# Altium schematic sheet DAC_AND_MIC.SchDoc
size A4; SheetNumber: 8; SheetTotal: 12
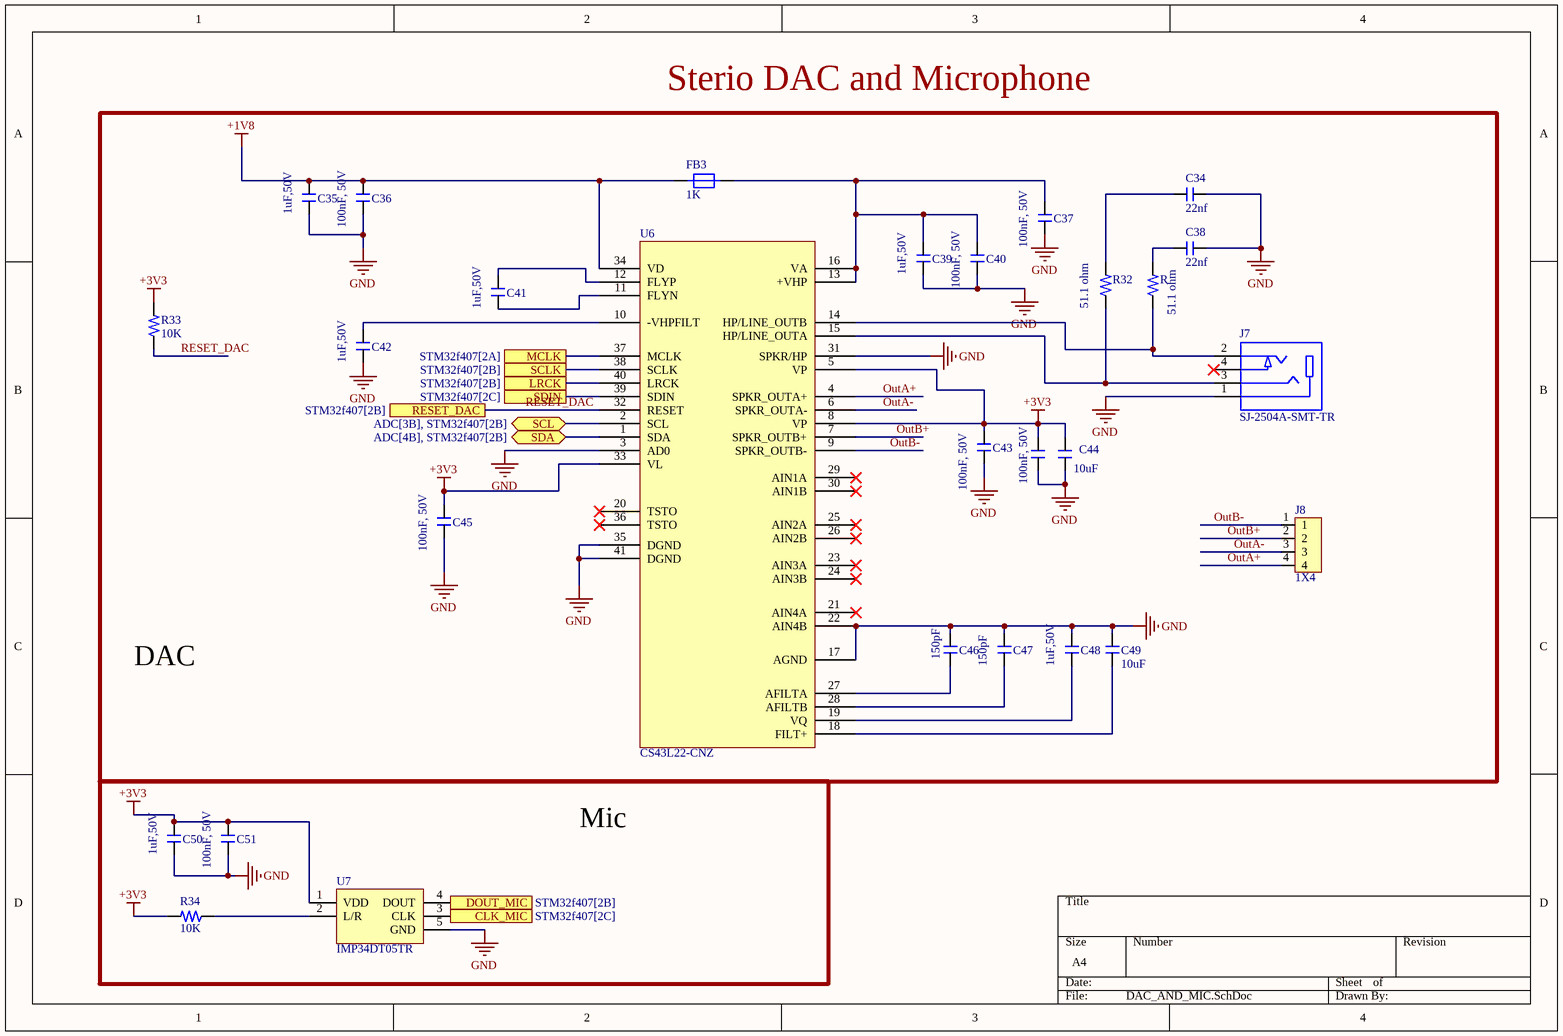
[diagram p0: DAC_AND_MIC.SchDoc]

## Parts
?  10uF  [Capacitor_1206_SMD]
C34  22nf  [Capacitor_0805]
C35  1uF,50V  [Capacitor_0805]
C36  100nF, 50V  [Capacitor_0805]
C37  100nF, 50V  [Capacitor_0805]
C38  22nf  [Capacitor_0805]
C39  1uF,50V  [Capacitor_0805]
C40  100nF, 50V  [Capacitor_0805]
C41  1uF,50V  [Capacitor_0805]
C42  1uF,50V  [Capacitor_0805]
C43  100nF, 50V  [Capacitor_0805]
C44  100nF, 50V  [Capacitor_0805]
C45  100nF, 50V  [Capacitor_0805]
C46  150pF  [Capacitor_0805]
C47  150pF  [Capacitor_0805]
C48  1uF,50V  [Capacitor_0805]
C49  10uF  [Capacitor_1206_SMD]
C50  1uF,50V  [Capacitor_0805]
C51  100nF, 50V  [Capacitor_0805]
FB3  1K  [FB_0805]
J7  SJ-2504A-SMT-TR  [CON_SJ-2504A-SMT-TR_SMD]
J8  1X4  [Header_1X4_2.54mm]
R  51.1 ohm  [Resistor_0603]
R32  51.1 ohm  [Resistor_0603]
R33  10K  [Resistor_0603]
R34  10K  [Resistor_0603]
U6  CS43L22-CNZ  [QFN40_19_284_33X9_SMD]
U7  IMP34DT05TR  [HCLGA-4_53_137_15X37_SMD]

## Blocks framed on the sheet
Sterio DAC and Microphone: ? C34-C49 FB3 J7 J8 R R32 R33 U6
Mic: C50 C51 R34 U7

## Ports
CLK_MIC (in, see STM32f407[2C]), DOUT_MIC (out, see STM32f407[2B]), LRCK (see STM32f407[2B]), MCLK (see STM32f407[2A]), RESET_DAC (see STM32f407[2B]), SCL (bidir, see ADC[3B], STM32f407[2B]), SCLK (see STM32f407[2B]), SDA (bidir, see ADC[4B], STM32f407[2B]), SDIN (see STM32f407[2C])

## Nets
+1V8: C35.2 C36.2 FB3.1 U6.34(VD)
+3V3: ?.2 C43.2 C44.2 C45.2 C50.2 C51.2 R33.2 R34.2 U6.5(VP) U6.8(VP) U6.33(VL) U7.1(VDD)
GND: ?.1 C34.2 C35.1 C36.1 C37.1 C38.2 C39.1 C40.1 C42.1 C43.1 C44.1 C45.1 C46.2 C47.2 C48.2 C49.2 C50.1 C51.1 J7.1 U6.3(AD0) U6.17(AGND) U6.22(AIN4B) U6.31(SPKR/HP) U6.35(DGND) U6.41(DGND) U7.5(GND)
CLK_MIC: U7.3(CLK) ; port CLK_MIC
DOUT_MIC: U7.4(DOUT) ; port DOUT_MIC
LRCK: U6.40(LRCK) ; port LRCK
MCLK: U6.37(MCLK) ; port MCLK
OutA+: J8.4 U6.4(SPKR_OUTA+)
OutA-: J8.3 U6.6(SPKR_OUTA-)
OutB+: J8.2 U6.7(SPKR_OUTB+)
OutB-: J8.1 U6.9(SPKR_OUTB-)
RESET_DAC: R33.1 U6.32(RESET) ; port RESET_DAC
SCL: U6.2(SCL) ; port SCL
SCLK: U6.38(SCLK) ; port SCLK
SDA: U6.1(SDA) ; port SDA
SDIN: U6.39(SDIN) ; port SDIN
NetC34_1: C34.1 R32.2
NetC37_2: C37.2 C39.2 C40.2 FB3.2 U6.13(+VHP) U6.16(VA)
NetC38_1: C38.1 R.2
NetC41_1: C41.1 U6.11(FLYN)
NetC41_2: C41.2 U6.12(FLYP)
NetC42_2: C42.2 U6.10(-VHPFILT)
NetC46_1: C46.1 U6.27(AFILTA)
NetC47_1: C47.1 U6.28(AFILTB)
NetC48_1: C48.1 U6.19(VQ)
NetC49_1: C49.1 U6.18(FILT+)
NetJ7_2: J7.2 R.1 U6.14(HP/LINE_OUTB)
NetJ7_3: J7.3 R32.1 U6.15(HP/LINE_OUTA)
NetR34_1: R34.1 U7.2(L/R)

Not connected (* = marked no-connect by the designer): J7 4*; U6 20(TSTO)* 21(AIN4A)* 23(AIN3A)* 24(AIN3B)* 25(AIN2A)* 26(AIN2B)* 29(AIN1A)* 30(AIN1B)* 36(TSTO)*

## Notes on the sheet
- DAC

## Library data of the parts
? C49 = Cap_10uF_1206: Multilayer Ceramic Capacitor, 10 uF, 50 V, ï¿½ 10%, X7R, 1206 [3216 Metric]; Manufacturer: Samsung; Manufacturer Part Number: CL31B106KBHNNNE; Voltage Rating (DC): 50V; Supplier: Digikey; Supplier Part Number: 1276-6767-1-ND; RoHS: Yes; Category: Ceramic Capacitors; Stock: 207136; Pricing: 1=0,25, 10=0,15, 100=0,1008, 1000=0,0728 (USD); Mounting Technology: Surface Mount; Case/Package: 1206; Case Code (Metric): 3216; Case Code (Imperial): 1206; Material: Ceramic; Min Operating Temperature: -55°C; Max Operating Temperature: 125°C; Value: 10uF; Tolerance: 10%; Dielectric: X7R; Packaging: Cut Tape; Voltage Rating: 50V; Series: CL; Height: 1.8mm; Lead Free: Lead Free; RoHS Compliant: Yes; ComponentLink1URL: https://datasheet.octopart.com/CL31B106KBHNNNE-Samsung-Electro-Mechanics-datasheet-149066874.pdf?src-supplier=Future+Electronics; ComponentLink1Description: https://datasheet.octopart.com/CL31B106KBHNNNE-Samsung-Electro-Mechanics-datasheet-149066874.pdf?src-supplier=Future+Electronics; ComponentLink2URL: http://www.samsungsem.com/kr/support/product-search/mlcc/CL31B106KBHNNNE.jsp?src-supplier=Digikey; ComponentLink2Description: http://www.samsungsem.com/kr/support/product-search/mlcc/CL31B106KBHNNNE.jsp?src-supplier=Digikey; ComponentLink3URL: https://datasheet.octopart.com/CL31B106KBHNNNE-Samsung-Electro-Mechanics-datasheet-137256395.pdf?src-supplier=Farnell; ComponentLink3Description: https://datasheet.octopart.com/CL31B106KBHNNNE-Samsung-Electro-Mechanics-datasheet-137256395.pdf?src-supplier=Farnell; ComponentLink4URL: https://datasheet.octopart.com/CL31B106KBHNNNE-Samsung-Electro-Mechanics-datasheet-110617700.pdf?src-supplier=LCSC; ComponentLink4Description: https://datasheet.octopart.com/CL31B106KBHNNNE-Samsung-Electro-Mechanics-datasheet-110617700.pdf?src-supplier=LCSC
C34 C38 = CAP_22nf_0805: Multilayer Ceramic Capacitor, 0.022 uF, 50 V, ± 10%, X7R, 0805 [2012 Metric]; Manufacturer: Samsung; Manufacturer Part Number: CL21B223KBANNNC; Voltage: 50V; Supplier: Arrow Electronics; Supplier Part Number: CL21B223KBANNNC; RoHS: Yes; Category: Ceramic Capacitors; Stock: 1612000; Pricing: 32000=0,0032 (USD); Mounting Technology: Surface Mount; Case/Package: 0805; Case Code (Metric): 2012; Case Code (Imperial): 0805; Material: Ceramic; Min Operating Temperature: -55°C; Max Operating Temperature: 125°C; Tolerance: 10%; Value: 22nF; Dielectric: X7R; Voltage Rating (DC): 50V; Packaging: Tape and Reel; Package Quantity: 1; Voltage Rating: 50V; Series: CL; Construction: Flat; Length: 2mm; Width: 0.049inch; Height: 0.65mm; Depth: 1.25mm; Thickness: 0.03inch; Radiation Hardening: No; RoHS Compliant: Yes; ComponentLink1URL: https://datasheet.ciiva.com/25800/cl21b223kbannnc-25800850.pdf?src-supplier=Digikey; ComponentLink1Description: https://datasheet.ciiva.com/25800/cl21b223kbannnc-25800850.pdf?src-supplier=Digikey; ComponentLink2URL: https://datasheet.ciiva.com/26838/getdatasheetpartid-498011-26838697.pdf?src-supplier=Verical; ComponentLink2Description: https://datasheet.ciiva.com/26838/getdatasheetpartid-498011-26838697.pdf?src-supplier=Verical; ComponentLink3URL: https://datasheet.ciiva.com/29199/454724-da-01-en-vs-kondensator-0805-29199517.pdf?src-supplier=Conrad; ComponentLink3Description: https://datasheet.ciiva.com/29199/454724-da-01-en-vs-kondensator-0805-29199517.pdf?src-supplier=Conrad
C35 C39 C41 C42 C48 C50 = Cap_1uF_0805: 0805 1 uF 50 V ±5 % Tolerance X7R Surface Mount Multilayer Ceramic Capacitor; Manufacturer: Yageo; Manufacturer Part Number: CC0805JKX7R9BB105; Material: 4241ConductorMaterial; Dielectric: 1511DielectricType; Supplier: Digikey; Supplier Part Number: 311-3498-1-ND; RoHS: Yes; Category: Ceramic Capacitors; Stock: 30160; Pricing: 1=0,29, 10=0,168, 100=0,1077, 1000=0,07673 (USD); Voltage Rating (DC): 50V; Height: 1.45mm; Lead Free: 5697LeadFree; Halogen Free: 5694HalogenFree; ComponentLink1URL: https://datasheet.octopart.com/CC0805JKX7R9BB105-Yageo-datasheet-137700082.pdf?src-supplier=Future+Electronics; ComponentLink1Description: https://datasheet.octopart.com/CC0805JKX7R9BB105-Yageo-datasheet-137700082.pdf?src-supplier=Future+Electronics; ComponentLink2URL: http://www.yageo.com/documents/recent/UPY-GPHC_X7R_6.3V-to-50V_18.pdf?src-supplier=Digikey; ComponentLink2Description: http://www.yageo.com/documents/recent/UPY-GPHC_X7R_6.3V-to-50V_18.pdf?src-supplier=Digikey; ComponentLink3URL: https://datasheet.octopart.com/CC0805JKX7R9BB105-Yageo-datasheet-151948686.pdf?src-supplier=Farnell; ComponentLink3Description: https://datasheet.octopart.com/CC0805JKX7R9BB105-Yageo-datasheet-151948686.pdf?src-supplier=Farnell
C36 C37 C40 C43-C45 C51 = Cap_100nF_0805: Multilayer Ceramic Capacitor, 0.1 uF, 50 V, ï¿½ 10%, X7R, 0805 [2012 Metric]; Manufacturer: Samsung; Manufacturer Part Number: CL21B104KBCNNNC; Supplier: Digikey; Supplier Part Number: 1276-1003-1-ND; RoHS: Yes; Category: Ceramic Capacitors; Stock: 674609; Pricing: 1=0,08, 10=0,012, 100=0,0104, 1000=0,008 (USD); Mounting Technology: Surface Mount; Case/Package: 0805; Case Code (Metric): 2012; Case Code (Imperial): 0805; Material: Ceramic; Min Operating Temperature: -55°C; Max Operating Temperature: 125°C; Tolerance: 10%; Value: 100nF; Dielectric: X7R; Packaging: Tape and Reel; Voltage Rating: 50V; Voltage: 50V; Series: CL; Construction: Flat; Voltage Rating (DC): 50V; Length: 2mm; Width: 0.049inch; Height: 0.85mm; Depth: 1.25mm; Thickness: 0.037inch; Radiation Hardening: No; RoHS Compliant: Yes; Lead Free: 5697LeadFree; ComponentLink1URL: https://datasheet.ciiva.com/25710/cl21b104kbcnnnc-25710182.pdf?src-supplier=Digikey; ComponentLink1Description: https://datasheet.ciiva.com/25710/cl21b104kbcnnnc-25710182.pdf?src-supplier=Digikey; ComponentLink2URL: https://datasheet.ciiva.com/29199/454152-da-01-en-vs-kondensator-0805-29199814.pdf?src-supplier=Conrad; ComponentLink2Description: https://datasheet.ciiva.com/29199/454152-da-01-en-vs-kondensator-0805-29199814.pdf?src-supplier=Conrad
C46 C47 = Cap_150pF_50V_0805: Cap Ceramic 150pF 50V C0G 10% SMD 0805 125°C Paper T/R; Manufacturer: Kyocera AVX; Manufacturer Part Number: 08055A151KAT2A; Material: 4241ConductorMaterial; Supplier: Avnet; Supplier Part Number: KGM21BCG1H151KT; RoHS: Yes; Category: Ceramic Capacitors; Stock: 316000; Pricing: 4000=0,0147, 8000=0,01463, 24000=0,01448, 32000=0,0144 (USD); Pins: 2NUMBER; ComponentLink1URL: https://datasheet.ciiva.com/204/ccog-204680.pdf?src-supplier=Digikey; ComponentLink1Description: https://datasheet.ciiva.com/204/ccog-204680.pdf?src-supplier=Digikey; ComponentLink2URL: https://datasheet.ciiva.com/11524/ccog-11524358.pdf?src-supplier=Avnet; ComponentLink2Description: https://datasheet.ciiva.com/11524/ccog-11524358.pdf?src-supplier=Avnet
FB3 = FB_BLM21SP102SH1D: Ferrite Beads Multi-Layer High Current 1KOhm 25% 100MHz 1.6A 0.12Ohm DCR 0805 Automotive T/R; Manufacturer: Murata; Core Material: 228ConductorMaterial; Value: 120mR; Supplier: Mouser; Supplier Part Number: 81-BLM21SP102SH1D; Manufacturer Part Number: BLM21SP102SH1D; RoHS: Yes; Category: Ferrite Beads and Chips; Stock: 4751; Pricing: 1=0,33, 10=0,179, 50=0,179, 100=0,159, 1000=0,105, 10000=0,083 (USD); RMS Current (Irms): 1.6A; ESR: 120mR; Test Frequency: 100MHz; Tolerance: 25%; Height: 1.05mm; ComponentLink1URL: https://datasheet.octopart.com/BLM21SP102SH1D-Murata-datasheet-138707452.pdf?src-supplier=Future+Electronics; ComponentLink1Description: https://datasheet.octopart.com/BLM21SP102SH1D-Murata-datasheet-138707452.pdf?src-supplier=Future+Electronics; ComponentLink2URL: https://www.murata.com/en-us/api/pdfdownloadapi?cate=luNoiseSupprFilteChipFerriBead&amp;partno=BLM21SP102SH1%23&src-supplier=Digikey; ComponentLink2Description: https://www.murata.com/en-us/api/pdfdownloadapi?cate=luNoiseSupprFilteChipFerriBead&amp;partno=BLM21SP102SH1%23&src-supplier=Digikey; ComponentLink3URL: https://datasheet.octopart.com/BLM21SP102SH1D-Murata-datasheet-166171483.pdf?src-supplier=TME; ComponentLink3Description: https://datasheet.octopart.com/BLM21SP102SH1D-Murata-datasheet-166171483.pdf?src-supplier=TME
J7 = CON-PLG-STEREO_4X1-100-RA-SMD: 2.5 mm, Stereo, Right Angle, Surface Mount (SMT), Audio Jack Connector; Manufacturer: Same Sky; Body Color: Black; Gender: Female; Shielding: Unshielded; Current Rating: 1A; Number of Conductors: 4NUMBER; Voltage Rating: 12V; Supplier: Mouser; Supplier Part Number: 490-SJ-2504A-SMT-TR; Manufacturer Part Number: SJ-2504A-SMT-TR; RoHS: No; Category: Audio / Video Connectors; Stock: 1979; Pricing: 1=0,91, 10=0,661, 50=0,661, 100=0,595, 1000=0,523, 10000=0,506 (USD); Mounting Technology: Surface Mount; Contact Plating: Silver; Contact Material: Copper Alloy; Insulation Color: Black; Housing Material: Nylon; Min Operating Temperature: -25°C; Max Operating Temperature: 85°C; Series: SJ; Termination: Solder; ComponentLink1URL: https://www.cui.com/product/resource/digikeypdf/sj-250x-smt.pdf?src-supplier=Digikey; ComponentLink1Description: https://www.cui.com/product/resource/digikeypdf/sj-250x-smt.pdf?src-supplier=Digikey; ComponentLink2URL: https://www.cuidevices.com/product/resource/digikeypdf/sj-250x-smt.pdf?src-supplier=Digikey; ComponentLink2Description: https://www.cuidevices.com/product/resource/digikeypdf/sj-250x-smt.pdf?src-supplier=Digikey; ComponentLink3URL: https://datasheet.octopart.com/SJ-2504A-SMT-TR-CUI-Devices-datasheet-175925684.pdf?src-supplier=Master+Electronics; ComponentLink3Description: https://datasheet.octopart.com/SJ-2504A-SMT-TR-CUI-Devices-datasheet-175925684.pdf?src-supplier=Master+Electronics
J8 = Header_Male_1X4_2.54: THT Vertical Pin Header WR-PHD, Pitch 2.54 mm, Single Row, 4 pins; Manufacturer: Wurth Electronics; Manufacturer Part Number: 61300411121; Number of Positions: 4; Gender: 29Gender; Contact Resistance: 20mR; Current Rating: 3A; Operating Supply Voltage: 250V; Pitch: 0.1inch; Supplier: Digikey; Supplier Part Number: 732-5317-ND; RoHS: Yes; Category: Headers and Wire Housings; Stock: 28749; Pricing: 1=0,17, 10=0,147, 25=0,1216, 50=0,1018, 100=0,0918, 1000=0,085 (USD); Mounting Technology: Through Hole; Contact Plating: Gold; Contact Material: Copper; Color: Black; Min Operating Temperature: -40°C; Max Operating Temperature: 105°C; Number of Rows: 1; Packaging: Bulk; Termination: Solder; Number of Contacts: 4; Series: WR-PHD; Contact Type: Male Pin; Voltage Rating: 250V; Orientation: 5495OrientationType; Height: 8.89mm; Contact Mating Length: 0.236inch; RoHS Compliant: Yes; Reach SVHC Compliant: Unknown; Lead Free: 5697LeadFree; ComponentLink1URL: http://www.farnell.com/cad/1737268.pdf?src-supplier=Element14; ComponentLink1Description: http://www.farnell.com/cad/1737268.pdf?src-supplier=Element14; ComponentLink2URL: https://datasheet.octopart.com/61300411121-W%C3%BCrth-Elektronik-datasheet-21154836.pdf?src-supplier=Element14; ComponentLink2Description: https://datasheet.octopart.com/61300411121-W%C3%BCrth-Elektronik-datasheet-21154836.pdf?src-supplier=Element14; ComponentLink3URL: https://katalog.we-online.de/em/datasheet/6130xx11121.pdf?src-supplier=Digikey; ComponentLink3Description: https://katalog.we-online.de/em/datasheet/6130xx11121.pdf?src-supplier=Digikey
R R32 = Res_51_ohm_0603: CRCW Series 0603 0.1 W 51.1 Ohm ±1 % ±100 ppm/K SMT Thick Film Chip Resistor; Manufacturer: Vishay; Manufacturer Part Number: CRCW060351R1FKEA; Value: 51.1R; Tolerance: 1%; Power Rating: 100mW; Voltage Rating: 75V; Temperature Coefficient: 100ppm/°C; Supplier: Mouser; Supplier Part Number: 71-CRCW0603-51.1-E3; RoHS: Yes; Category: Chip SMD Resistors; Stock: 22998; Pricing: 1=0,1, 10=0,017, 50=0,017, 100=0,013, 1000=0,009, 10000=0,005 (USD); Case/Package: 0603; Pins: 2; Weight: 7.1E-05oz; Case Code (Metric): 1608; Case Code (Imperial): 0603; Contact Plating: Tin; Min Operating Temperature: -55°C; Max Operating Temperature: 155°C; Packaging: Tape and Reel; Package Quantity: 10; Resistor Type: Thick Film; Number of Terminations: 2; Termination: SMD/SMT; Max Power Dissipation: 100mW; Voltage Rating (DC): 75V; Features: Automotive AEC-Q200; Series: CRCW; Technology: THICK FILM; Resistance Tolerance: 1%; Construction: Rectangular; Length: 1.55mm; Width: 0.033inch; Height: 0.45mm; Depth: 0.85mm; Radiation Hardening: No; RoHS Compliant: Yes; Military Standard: Not; Lead Free: Lead Free; Reach SVHC Compliant: Unknown; ComponentLink1URL: https://datasheet.ciiva.com/11810/0900766b80d98afc-11810706.pdf?src-supplier=Rs; ComponentLink1Description: https://datasheet.ciiva.com/11810/0900766b80d98afc-11810706.pdf?src-supplier=Rs; ComponentLink2URL: https://datasheet.ciiva.com/16768/70201119-16768809.pdf?src-supplier=Allied+Electronics; ComponentLink2Description: https://datasheet.ciiva.com/16768/70201119-16768809.pdf?src-supplier=Allied+Electronics; ComponentLink3URL: https://datasheet.ciiva.com/16771/70201119-16771272.pdf?src-supplier=Allied+Electronics; ComponentLink3Description: https://datasheet.ciiva.com/16771/70201119-16771272.pdf?src-supplier=Allied+Electronics; ComponentLink4URL: https://datasheet.ciiva.com/3257/dcrcwe3-3257704.pdf?src-supplier=Avnet; ComponentLink4Description: https://datasheet.ciiva.com/3257/dcrcwe3-3257704.pdf?src-supplier=Avnet; ComponentLink5URL: https://datasheet.ciiva.com/16494/dcrcwe3-16494476.pdf?src-supplier=Future+Electronics; ComponentLink5Description: https://datasheet.ciiva.com/16494/dcrcwe3-16494476.pdf?src-supplier=Future+Electronics; ComponentLink6URL: https://datasheet.ciiva.com/5552/dcrcwe3-109170-5552666.pdf?src-supplier=Mouser; ComponentLink6Description: https://datasheet.ciiva.com/5552/dcrcwe3-109170-5552666.pdf?src-supplier=Mouser; ComponentLink7URL: https://datasheet.ciiva.com/7732/1533075-7732214.pdf?src-supplier=Element14; ComponentLink7Description: https://datasheet.ciiva.com/7732/1533075-7732214.pdf?src-supplier=Element14; ComponentLink8URL: https://datasheet.ciiva.com/5936/1533075-5936121.pdf?src-supplier=Farnell; ComponentLink8Description: https://datasheet.ciiva.com/5936/1533075-5936121.pdf?src-supplier=Farnell; ComponentLink9URL: https://datasheet.ciiva.com/2465/dcrcwe3-2465739.pdf?src-supplier=Digikey; ComponentLink9Description: https://datasheet.ciiva.com/2465/dcrcwe3-2465739.pdf?src-supplier=Digikey; ComponentLink10URL: https://datasheet.ciiva.com/2465/dcrcwe3-2465740.pdf?src-supplier=Digikey; ComponentLink10Description: https://datasheet.ciiva.com/2465/dcrcwe3-2465740.pdf?src-supplier=Digikey; ComponentLink11URL: https://datasheet.ciiva.com/2465/dcrcwe3-2465738.pdf?src-supplier=Digikey; ComponentLink11Description: https://datasheet.ciiva.com/2465/dcrcwe3-2465738.pdf?src-supplier=Digikey
R33 R34 = R_10K_0603: SMD Chip Resistor, 10 kOhm, ï¿½ 1%, 100 mW, 0603 [1608 Metric], Thick Film, General Purpose; Manufacturer: Yageo; Manufacturer Part Number: RC0603FR-0710KL; Voltage Rating (DC): 50V; Value: 10kR; Temperature Coefficient: 100ppm/°C; Voltage Rating: 75V; Power Rating: 100mW; Supplier: Digikey; Supplier Part Number: 311-10.0KHRCT-ND; RoHS: Yes; Category: Chip SMD Resistors; Stock: 2808060; Pricing: 1=0,1, 10=0,009, 100=0,0071, 1000=0,00612 (USD); Case/Package: 0603; Pins: 2; Case Code (Imperial): 0603; Case Code (Metric): 1608; Weight: 7.1E-05oz; Min Operating Temperature: -55°C; Max Operating Temperature: 155°C; Tolerance: 1%; Resistor Type: Thick Film; Packaging: Tape and Reel; Termination: SMD/SMT; Features: Moisture Resistant; Series: RC; Max Power Dissipation: 100mW; Number of Terminations: 2; Resistance Tolerance: 1%; Construction: Rectangular; Length: 1.6mm; Width: 0.8mm; Height: 0.45mm; Depth: 0.8mm; Lead Pitch: 0.3mm; Reach SVHC Compliant: No; Lead Free: 5697LeadFree; RoHS Compliant: Yes; Military Standard: Not; ComponentLink1URL: https://datasheet.ciiva.com/7660/38590-7660789.pdf?src-supplier=Element14; ComponentLink1Description: https://datasheet.ciiva.com/7660/38590-7660789.pdf?src-supplier=Element14; ComponentLink2URL: https://datasheet.ciiva.com/7983/443971-7983596.pdf?src-supplier=Element14; ComponentLink2Description: https://datasheet.ciiva.com/7983/443971-7983596.pdf?src-supplier=Element14; ComponentLink3URL: https://datasheet.ciiva.com/22747/443971-22747519.pdf?src-supplier=Element14; ComponentLink3Description: https://datasheet.ciiva.com/22747/443971-22747519.pdf?src-supplier=Element14; ComponentLink4URL: https://datasheet.ciiva.com/46440/1868787-46440891.pdf?src-supplier=Element14; ComponentLink4Description: https://datasheet.ciiva.com/46440/1868787-46440891.pdf?src-supplier=Element14; ComponentLink5URL: https://datasheet.ciiva.com/7746/1738695-7746239.pdf?src-supplier=Element14; ComponentLink5Description: https://datasheet.ciiva.com/7746/1738695-7746239.pdf?src-supplier=Element14; ComponentLink6URL: https://datasheet.ciiva.com/15189/getdatasheetpartid-409289-15189591.pdf?src-supplier=Verical; ComponentLink6Description: https://datasheet.ciiva.com/15189/getdatasheetpartid-409289-15189591.pdf?src-supplier=Verical
U6 = IC_CS43L22-CNZR: DAC 1-CH Delta-Sigma 24-bit 40-Pin QFN EP T/R; Manufacturer: Cirrus Logic; Number of DAC Channels: 1; Max Supply Voltage: 2.63V; Min Supply Voltage: 1.65V; Interface: Serial; Sampling Rate: 96000S/s; Resolution: 24b; Supply Type: Analog,Digital; Conversion Rate: 96KS/s; Output Type: Voltage; Output Polarity: Bipolar; Supplier: LCSC; Supplier Part Number: C17583512; Manufacturer Part Number: CS43L22-CNZR; RoHS: Yes; Category: Digital to Analog Converters (DACs); Stock: 7; Pricing: 1=3,9782, 10=3,8855, 30=3,8221, 100=3,7603 (USD); Mounting Technology: Surface Mount; Case/Package: QFN; Pins: 40; Contact Plating: Tin,Matte; Min Operating Temperature: -40°C; Max Operating Temperature: 85°C; Package Quantity: 4000; Packaging: Tape and Reel; Number of Converters: 1; Series: -; RoHS Compliant: Yes; ComponentLink1URL: https://datasheet.ciiva.com/4780/cs43l22-f2-15008-4780584.pdf?src-supplier=Mouser; ComponentLink1Description: https://datasheet.ciiva.com/4780/cs43l22-f2-15008-4780584.pdf?src-supplier=Mouser; ComponentLink2URL: https://datasheet.ciiva.com/6671/cs43l22-f2-6671584.pdf?src-supplier=Digikey; ComponentLink2Description: https://datasheet.ciiva.com/6671/cs43l22-f2-6671584.pdf?src-supplier=Digikey; ComponentLink3URL: https://datasheet.ciiva.com/3041/cs43l22-f2-3041091.pdf?src-supplier=Avnet; ComponentLink3Description: https://datasheet.ciiva.com/3041/cs43l22-f2-3041091.pdf?src-supplier=Avnet
U7 = IC_MIC_IMP34DT05TR: IMP34DT05: 3.6V MEMS Audio Sensor Omnidirectional Digital Microphone - HCLGA-4LD; Manufacturer: STMicroelectronics; Shape: Rectangular; Voltage Rating: 1.8V; Operating Supply Current: 650uA; Value: 100pF; Frequency: 2.4MHz; Min Supply Voltage: 1.6V; Power Supply Rejection Ratio (PSRR): 64dB; Supplier: Arrow Electronics; Supplier Part Number: IMP34DT05TR; Manufacturer Part Number: IMP34DT05TR; RoHS: Yes; Category: Microphones; Stock: 40000; Pricing: 4000=1,0904 (USD); Min Operating Temperature: -40°C; Max Operating Temperature: 85°C; Direction: Omnidirectional; Packaging: Cut Tape; Termination: Solder; Series: -; Current: 650uA; Max Supply Voltage: 3.6V; Nominal Supply Current: 650uA; Operating Supply Voltage: 1.8V; Signal to Noise Ratio (SNR): 64dB; Height: 1.1mm; RoHS Compliant: Yes; ComponentLink1URL: https://www.st.com/resource/en/datasheet/imp34dt05.pdf?src-supplier=Digikey; ComponentLink1Description: https://www.st.com/resource/en/datasheet/imp34dt05.pdf?src-supplier=Digikey